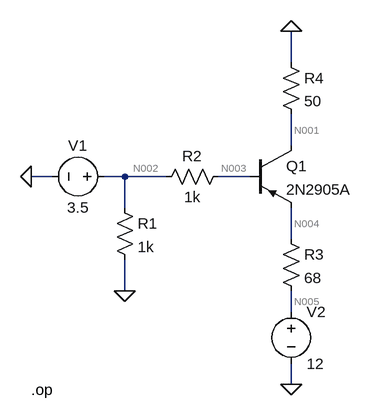
[diagram p0: schematic klucz_4.asc]
klucz_4.asc, the LTspice schematic file:
Version 4
SHEET 1 880 680
WIRE 448 -32 448 -80
WIRE 448 96 448 48
WIRE 80 144 48 144
WIRE 192 144 160 144
WIRE 256 144 192 144
WIRE 384 144 336 144
WIRE 192 192 192 144
WIRE 448 240 448 192
WIRE 192 320 192 272
WIRE 448 352 448 320
WIRE 448 464 448 432
FLAG 192 320 0
FLAG 448 464 0
FLAG 448 -80 0
FLAG 48 144 0
SYMBOL voltage 176 144 R90
WINDOW 0 -32 56 VBottom 2
WINDOW 3 32 56 VTop 2
WINDOW 123 0 0 Left 0
WINDOW 39 0 0 Left 0
SYMATTR InstName V1
SYMATTR Value 3.5
SYMBOL res 176 176 R0
SYMATTR InstName R1
SYMATTR Value 1k
SYMBOL res 352 128 R90
WINDOW 0 0 56 VBottom 2
WINDOW 3 32 56 VTop 2
SYMATTR InstName R2
SYMATTR Value 1k
SYMBOL res 432 224 R0
SYMATTR InstName R3
SYMATTR Value 68
SYMBOL res 432 -48 R0
SYMATTR InstName R4
SYMATTR Value 50
SYMBOL pnp 384 96 R0
SYMATTR InstName Q1
SYMATTR Value 2N2905A
SYMBOL voltage 448 336 R0
WINDOW 123 0 0 Left 0
WINDOW 39 0 0 Left 0
SYMATTR InstName V2
SYMATTR Value 12
TEXT 48 472 Left 2 !.op

The netlist it stands for:
* klucz_4.asc
V1 N002 0 3.5
R1 N002 0 1k
R2 N003 N002 1k
R3 N004 N005 68
R4 0 N001 50
Q1 N001 N003 N004 0 2N2905A
V2 N005 0 12
.model NPN NPN
.model PNP PNP
.lib standard.bjt
.op
.backanno
.end

* Results of the author's LTspice run, read from the files saved beside the schematic
* Operating Point:
*   V(n002) = 3.5 V
*   V(n003) = 4.314 V
*   V(n004) = 5.17 V
*   V(n005) = 12 V
*   V(n001) = 4.981 V
*   Ic(Q1) = -99.63 mA
*   Ib(Q1) = -814.1 µA
*   Ie(Q1) = 100.4 mA
*   I(R4) = -99.63 mA
*   I(R3) = -100.4 mA
*   I(R2) = 814.1 µA
*   I(R1) = 3.5 mA
*   I(V2) = -100.4 mA
*   I(V1) = -2.686 mA
* From the log:
*   Semiconductor Device Operating Points:
*                           --- Bipolar Transistors ---
*   Name:       q1
*   Model:    2n2905a
*   Ib:      -8.14e-04
*   Ic:      -9.96e-02
*   Vbe:     -8.56e-01
*   Vbc:     -6.67e-01
*   Vce:     -1.88e-01
*   BetaDC:   1.22e+02
*   Gm:       3.56e+00
*   Rpi:      5.37e+01
*   Rx:       1.00e+01
*   Ro:       2.33e+01
*   Cbe:      2.46e-09
*   Cbc:      5.18e-09
*   Cjs:      0.00e+00
*   BetaAC:   1.91e+02
*   Cbx:      0.00e+00
*   Ft:       7.42e+07